# EAGLE design honda-z50a-regulator (EAGLE 9.5.1)
CNAME: None; CREVISION: 1.0; DESIGNER: Joao Silva
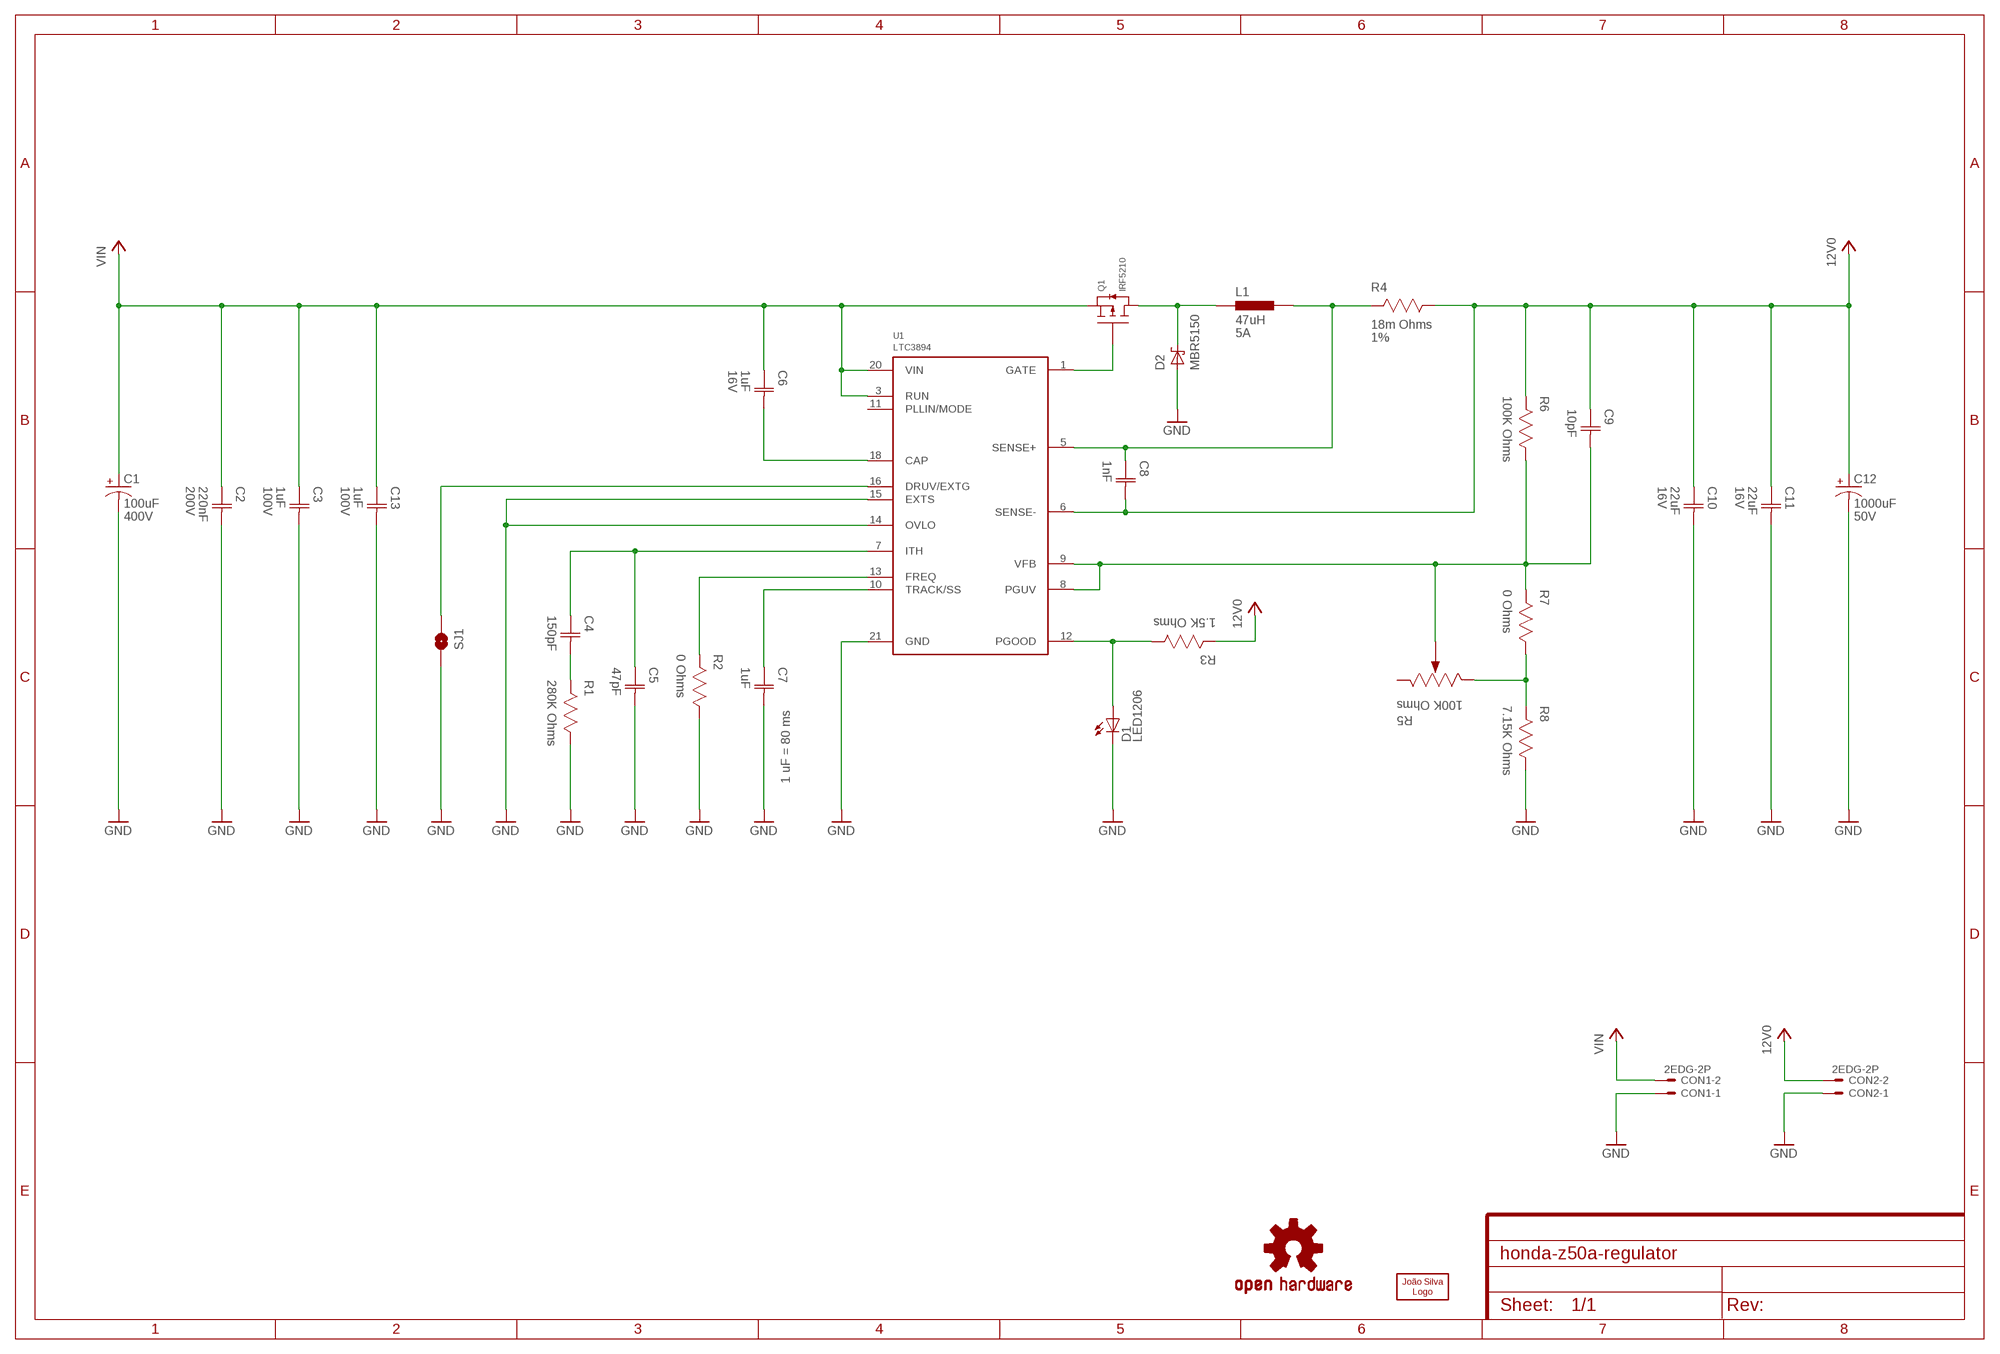
[diagram p0: schematic, sheet 1]

## Parts
C1  100uF  ELETROLITIC-CAPACITOR-18MM  [EL-CAP-18MM]
C2  220nF  CAPACITOR-1206  [CAP1206]
C3  1uF  CAPACITOR-1206  [CAP1206]
C4  150pF  CAPACITOR-0603  [CAP0603]
C5  47pF  CAPACITOR-0603  [CAP0603]
C6  1uF  CAPACITOR-0603  [CAP0603]
C7  1uF  CAPACITOR-0603  [CAP0603]
C8  1nF  CAPACITOR-0603  [CAP0603]
C9  10pF  CAPACITOR-0603  [CAP0603]
C10  22uF  CAPACITOR-1206  [CAP1206]
C11  22uF  CAPACITOR-1206  [CAP1206]
C12  1000uF  ELETROLITIC-CAPACITOR-13MM  [EL-CAP-13MM]
C13  1uF  CAPACITOR-1206  [CAP1206]
CON1  2EDG-2P  [2EDG-2P]
CON2  2EDG-2P  [2EDG-2P]
D1  LED1206  [1206]
D2  MBR5150  [DO201AD]
L1  47uH  INDUCTOR-13X13X6.5MM  [IND1365]
LOGO1  OSHW-LOGOS  [OSHW-LOGO-S]
LOGO2  JS-5MM  [JS_5MM]
Q1  IRF5210  [TO262-HS]
R1  280K Ohms  RESISTOR-0603  [RES0603]
R2  0 Ohms  RESISTOR-0603  [RES0603]
R3  1.5K Ohms  RESISTOR-0603  [RES0603]
R4  18m Ohms  RESISTOR-2512  [RES2512]
R5  100K Ohms  POTENTIOMETER-TH  [TRIMMER]
R6  100K Ohms  RESISTOR-0603  [RES0603]
R7  0 Ohms  RESISTOR-0603  [RES0603]
R8  7.15K Ohms  RESISTOR-0603  [RES0603]
SJ1  SJS  [SJ_S]
U1  LTC3894  [MSOP20_HV_EP]

## Nets
12V0: C8.2(C2) C9.1(C1) C10.1(C1) C11.1(C1) C12.+ CON2.P$2 R3.2 R4.1 R6.2 U1.6(SENSE-)
CAP: C6.2(C2) U1.18(CAP)
DRUV: SJ1.1 U1.16(DRUV/EXTG)
FREQ: R2.2 U1.13(FREQ)
GATE: Q1.G U1.1(GATE)
GND: C1.- C2.2(C2) C3.2(C2) C5.2(C2) C7.2(C2) C10.2(C2) C11.2(C2) C12.- C13.2(C2) CON1.P$1 CON2.P$1 D1.C D2.A R1.1 R2.1 R8.1 SJ1.2 U1.14(OVLO) U1.15(EXTS) U1.21(GND)
ISENSE: C8.1(C1) L1.2 R4.2 U1.5(SENSE+)
ITH: C4.1(C1) C5.1(C1) U1.7(ITH)
N$1: R5.E(CW) R7.1 R8.2
N$9: C4.2(C2) R1.2
PGOOD: D1.A R3.1 U1.12(PGOOD)
SS: C7.1(C1) U1.10(TRACK/SS)
SW [HV]: D2.C L1.1 Q1.D
VFB: C9.2(C2) R5.S(WIPER) R6.1 R7.2 U1.8(PGUV) U1.9(VFB)
VIN [HV]: C1.+ C2.1(C1) C3.1(C1) C6.1(C1) C13.1(C1) CON1.P$2 Q1.S U1.3(RUN) U1.20(VIN)
Unconnected: R5.A(CCW) U1.11(PLLIN/MODE)

## Notes on the sheet
- 1 uF = 80 ms

## Library data of the parts
C1 = Capacitor:ELETROLITIC-CAPACITOR; VOLTAGE: 400V
C2 = Capacitor:CAPACITOR; VOLTAGE: 200V
C3 C13 = Capacitor:CAPACITOR; VOLTAGE: 100V
C4 C5 C7-C9 = Capacitor:CAPACITOR
C6 C10 C11 = Capacitor:CAPACITOR; VOLTAGE: 16V
C12 = Capacitor:ELETROLITIC-CAPACITOR; VOLTAGE: 50V
CON1 CON2 = Generic Connector:2EDG-2P
D1 = LED:LED
D2 = Generic Diode:MBR5150
L1 = Inductor:INDUCTOR; CURRENT: 5A; OCLCSC: C429835
LOGO1 = Silkscreen:OSHW-LOGO: Open-Source Hardware (OSHW) Logo This logo indicates the piece of hardware it is found on incorporates a OSHW license and/or adheres to the definition of open source hardware found here: http://freedomdefined.org/OSHW
LOGO2 = Silkscreen:JS
Q1 = Generic MOSFET:IRF5210
R1-R3 R6-R8 = Resistor:RESISTOR
R4 = Resistor:RESISTOR; OCLCSC: C270951; TOLERANCE: 1%
R5 = Potentiometer:POTENTIOMETER
SJ1 = Solder Jumper:SJ
U1 = Analog Devices:LTC3894

## Net classes
1 HV: clearance 0.8 mm

## Board
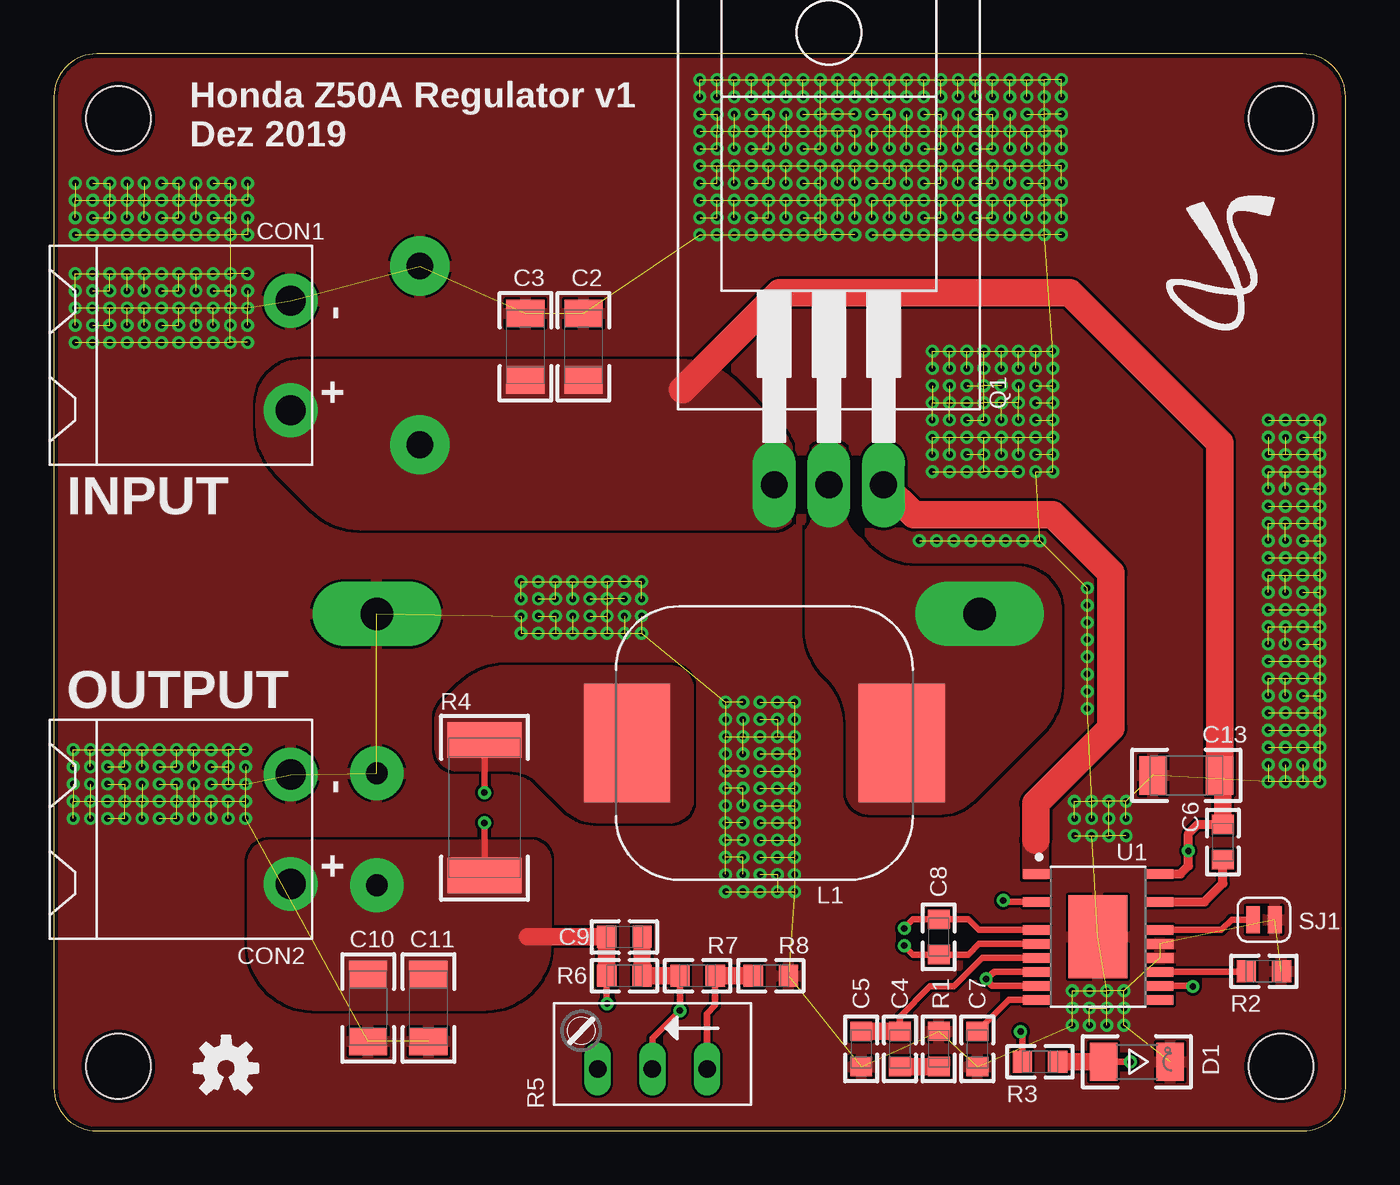
[diagram p1: board, top side]
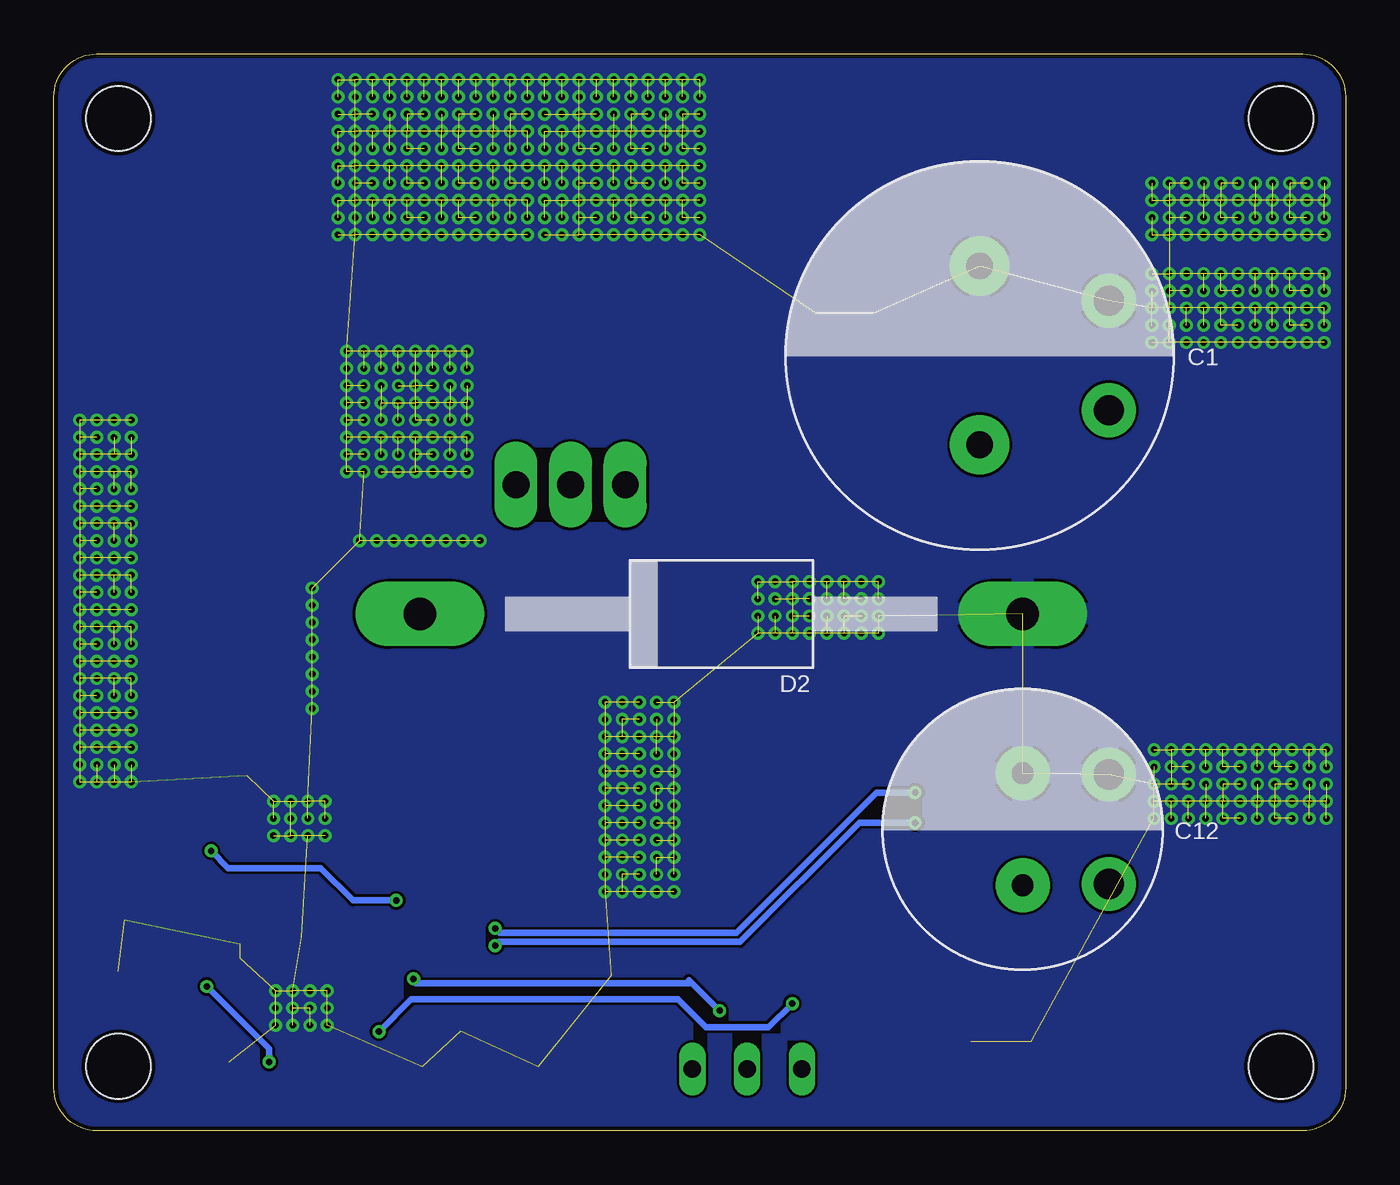
[diagram p2: board, bottom side, seen from below]

Size 60 x 50 mm. Coordinates in mm from the lower left corner, seen from the top.
Outline: 0,48 0,2 arc90 2,0 58,0 arc90 60,2 60,48 arc90 58,50 2,50 arc90 0,48
Copper layers (1*16): Top 0.035mm / dielectric 1.6mm / Bottom 0.035mm
Design rules "jlcpcb_2layer": minimum track width 5mil, minimum drill 0.3mm, track to track 5mil, track to pad 5mil, pad to pad 5mil, via to via 5mil, smd to smd 5mil, copper to edge 0.2mm, drill to drill 5mil, minimum pad ring 3mil, minimum via ring 3mil, stop-mask expansion 0.075mm, vias tented up to drill 10mm, thermal gap 5mil
Holes 3 mm at 57,3 3,47 57,47 3,3

### Footprints (pad centres in the part's own frame; a part is rotated, then mirrored left to right if it is on the bottom)
EL-CAP-18MM = drill 1.25 pad 2.75: + -4.15,0; - 4.15,0
CAP1206 = smd 1.27 x 1.778: 1 -1.549,0; 2 1.549,0
CAP0603 = smd 0.889 x 1.016: 1 -0.819,0; 2 0.819,0
EL-CAP-13MM = drill 1 pad 2.5: + -2.6,0; - 2.6,0
2EDG-2P = drill 1.4 pad 2.5: P$1 -2.54,0; P$2 2.54,0
1206 = smd 1.27 x 1.778: A 1.549,0; C -1.549,0
DO201AD = drill 1.5 pad 3 long: A -14,0; C 14,0
IND1365 = smd 4 x 5.5: 1 -6.375,0; 2 6.375,0
TO262-HS = drill 1.25 pad 2 long: D 0,-9; G 2.54,-9; S -2.54,-9
RES0603 = smd 0.889 x 1.016: 1 -0.819,0; 2 0.819,0
RES2512 = smd 1.651 x 3.429: 1 -3.15,0; 2 3.15,0
TRIMMER = drill 0.813 long: A 2.54,0.635; E -2.54,0.635; S 0,0.635
SJ_S = smd 0.635 x 1.27: 1 -0.508,0; 2 0.508,0
MSOP20_HV_EP = smd 1.25 x 0.45: 1 -2.875,2.925; 3 -2.875,1.625; 5 -2.875,0.325; 6 -2.875,-0.325; 7 -2.875,-0.975; 8 -2.875,-1.625; 9 -2.875,-2.275; 10 -2.875,-2.925; 11 2.875,-2.925; 12 2.875,-2.275; 13 2.875,-1.625; 14 2.875,-0.975; 15 2.875,-0.325; 16 2.875,0.325; 18 2.875,1.625; 20 2.875,2.925 | smd 2.74 x 3.86: 21 0,0

### Placement (x,y rotation side)
C1  17,36 90 bottom
C2  24.6,36.4 90 top
C3  21.9,36.4 90 top
C4  39.3,3.8 270 top
C5  37.5,3.8 270 top
C6  54.3,13.4 270 top
C7  42.9,3.8 270 top
C8  41.1,9 270 top
C9  26.5,9 0 top
C10  14.6,5.7 270 top
C11  17.4,5.7 270 top
C12  15,14 90 bottom
C13  52.6,16.5 180 top
CON1  11,36 270 top
CON2  11,14 270 top
D1  50.3,3.2 180 top
D2  29,24 180 bottom
L1  33,18 180 top
LOGO1  8,2.9 0 top
LOGO2  56.9,43.6 0 top
Q1  36,39 0 top
R1  41.1,3.8 270 top
R2  56.2,7.4 180 top
R3  45.8,3.2 180 top
R4  20,15 90 top
R5  27.8,3.5 180 top
R6  26.5,7.2 180 top
R7  29.9,7.2 180 top
R8  33.3,7.2 180 top
SJ1  56.2,9.8 0 top
U1  48.5,9 0 top

### Tracks (layer width: path | path; a pad name or v marks a point on that pad's centre or on a via)
12V0  (via drill 0.3)
  Top 0.305: R4.1 v20,14.3 | v39.5,8.6 39.5,8.58 39.9,8.18 C8.2 42.48,8.18 42.98,8.68 U1.6 | R6.2 25.68,5.92 v25.7,5.9 | v44.9,4.6 44.98,4.52 R3.2
  Top 0.813: 22,9 C9.1 R6.2
  Bottom 0.305: v20,14.3 22.59,14.3 28.12,8.77 39.33,8.77 v39.5,8.6 | v25.7,5.9 26.8,4.8 29.7,4.8 31,6.1 43.4,6.1 v44.9,4.6
  pour Top (no thermals): 23,12.5 23,8.7 arc-90 20,5.7 12.1,5.7 arc-90 9.1,8.7 9.1,12.4 arc-90 10.1,13.4 22.1,13.4 arc-90
CAP
  Top 0.406: U1.18 53.44,10.62 54.3,11.48 C6.2
DRUV
  Top 0.305: U1.16 54.23,9.32 54.7,9.8 SJ1.1
FREQ
  Top 0.305: U1.13 55.36,7.38 R2.2
GATE
  Top 1.27: Q1.G 39.94,28.6 46.4,28.6 49.1,25.9 49.1,18.7 45.6,15.2 45.6,13.5
  pour Top (no thermals): 46.1,11.8 45.1,11.8 45.1,13.7 46.1,13.7
GND  (via drill 0.3)  (677 unrouted)
  other vias: 1,41.6 1.8,41.6 2.6,41.6 3.4,41.6 4.2,41.6 5,41.6 5.8,41.6 6.6,41.6 7.4,41.6 1,42.4 1.8,42.4 2.6,42.4 3.4,42.4 4.2,42.4 5,42.4 5.8,42.4 6.6,42.4 7.4,42.4 1,43.2 1.8,43.2 2.6,43.2 3.4,43.2 4.2,43.2 5,43.2 5.8,43.2 6.6,43.2 7.4,43.2 1,44 1.8,44 2.6,44 3.4,44 4.2,44 5,44 5.8,44 6.6,44 7.4,44 8.2,41.6 9,41.6 8.2,42.4 9,42.4 8.2,43.2 9,43.2 8.2,44 9,44 1,39.8 1.8,39.8 2.6,39.8 3.4,39.8 4.2,39.8 5,39.8 5.8,39.8 6.6,39.8 7.4,39.8 1,36.6 1.8,36.6 2.6,36.6 3.4,36.6 4.2,36.6 5,36.6 5.8,36.6 6.6,36.6 7.4,36.6 1,37.4 1.8,37.4 2.6,37.4 3.4,37.4 4.2,37.4 5,37.4 5.8,37.4 6.6,37.4 7.4,37.4 1,38.2 1.8,38.2 2.6,38.2 3.4,38.2 4.2,38.2 5,38.2 5.8,38.2 6.6,38.2 7.4,38.2 1,39 1.8,39 2.6,39 3.4,39 4.2,39 5,39 5.8,39 6.6,39 7.4,39 8.2,39.8 9,39.8 8.2,36.6 9,36.6 8.2,37.4 9,37.4 8.2,38.2 9,38.2 8.2,39 9,39 30,44.8 30.8,44.8 31.6,44.8 32.4,44.8 33.2,44.8 34,44.8 34.8,44.8 35.6,44.8 36.4,44.8 30,41.6 30.8,41.6 31.6,41.6 32.4,41.6 33.2,41.6 34,41.6 34.8,41.6 35.6,41.6 36.4,41.6 30,42.4 30.8,42.4 31.6,42.4 32.4,42.4 33.2,42.4 34,42.4 34.8,42.4 35.6,42.4 36.4,42.4 30,43.2 30.8,43.2 31.6,43.2 32.4,43.2 33.2,43.2 34,43.2 34.8,43.2 35.6,43.2 36.4,43.2 30,44 30.8,44 31.6,44 32.4,44 33.2,44 34,44 34.8,44 35.6,44 36.4,44 37.2,44.8 38,44.8 37.2,41.6 38,41.6 37.2,42.4 38,42.4 37.2,43.2 38,43.2 37.2,44 38,44 30,48.8 30.8,48.8 31.6,48.8 32.4,48.8 33.2,48.8 34,48.8 34.8,48.8 35.6,48.8 36.4,48.8 30,45.6 30.8,45.6 31.6,45.6 32.4,45.6 33.2,45.6 34,45.6 34.8,45.6 35.6,45.6 36.4,45.6 30,46.4 30.8,46.4 31.6,46.4 32.4,46.4 33.2,46.4 34,46.4 34.8,46.4 35.6,46.4 36.4,46.4 30,47.2 30.8,47.2 31.6,47.2 32.4,47.2 33.2,47.2 34,47.2 34.8,47.2 35.6,47.2 36.4,47.2 30,48 30.8,48 31.6,48 32.4,48 33.2,48 34,48 34.8,48 35.6,48 36.4,48 37.2,48.8 38,48.8 37.2,45.6 38,45.6 37.2,46.4 38,46.4 37.2,47.2 38,47.2 37.2,48 38,48 38.8,44.8 39.6,44.8 40.4,44.8 41.2,44.8 42,44.8 42.8,44.8 43.6,44.8 44.4,44.8 45.2,44.8 38.8,41.6 39.6,41.6 40.4,41.6 41.2,41.6 42,41.6 42.8,41.6 43.6,41.6 44.4,41.6 45.2,41.6 38.8,42.4 39.6,42.4 40.4,42.4 41.2,42.4 42,42.4 42.8,42.4 43.6,42.4 44.4,42.4 45.2,42.4 38.8,43.2 39.6,43.2 40.4,43.2 41.2,43.2 42,43.2 42.8,43.2 43.6,43.2 44.4,43.2 45.2,43.2 38.8,44 39.6,44 40.4,44 41.2,44 42,44 42.8,44 43.6,44 44.4,44 45.2,44 46,44.8 46.8,44.8 46,41.6 46.8,41.6 46,42.4 46.8,42.4 46,43.2 46.8,43.2 46,44 46.8,44 38.8,48.8 39.6,48.8 40.4,48.8 41.2,48.8 42,48.8 42.8,48.8 43.6,48.8 44.4,48.8 45.2,48.8 38.8,45.6 39.6,45.6 40.4,45.6 41.2,45.6 42,45.6 42.8,45.6 43.6,45.6 44.4,45.6 45.2,45.6 38.8,46.4 39.6,46.4 40.4,46.4 41.2,46.4 42,46.4 42.8,46.4 43.6,46.4 44.4,46.4 45.2,46.4 38.8,47.2 39.6,47.2 40.4,47.2 41.2,47.2 42,47.2 42.8,47.2 43.6,47.2 44.4,47.2 45.2,47.2 38.8,48 39.6,48 40.4,48 41.2,48 42,48 42.8,48 43.6,48 44.4,48 45.2,48 46,48.8 46.8,48.8 46,45.6 46.8,45.6 46,46.4 46.8,46.4 46,47.2 46.8,47.2 46,48 46.8,48 40.8,32.2 41.6,32.2 42.4,32.2 43.2,32.2 44,32.2 44.8,32.2 40.8,30.6 41.6,30.6 42.4,30.6 43.2,30.6 44,30.6 44.8,30.6 40.8,31.4 41.6,31.4 42.4,31.4 43.2,31.4 44,31.4 44.8,31.4 45.6,32.2 46.4,32.2 45.6,30.6 46.4,30.6 45.6,31.4 46.4,31.4 40.8,36.2 41.6,36.2 42.4,36.2 43.2,36.2 44,36.2 44.8,36.2 40.8,33 41.6,33 42.4,33 43.2,33 44,33 44.8,33 40.8,33.8 41.6,33.8 42.4,33.8 43.2,33.8 44,33.8 44.8,33.8 40.8,34.6 41.6,34.6 42.4,34.6 43.2,34.6 44,34.6 44.8,34.6 40.8,35.4 41.6,35.4 42.4,35.4 43.2,35.4 44,35.4 44.8,35.4 45.6,36.2 46.4,36.2 45.6,33 46.4,33 45.6,33.8 46.4,33.8 45.6,34.6 46.4,34.6 45.6,35.4 46.4,35.4 40.2,27.4 41,27.4 41.8,27.4 42.6,27.4 43.4,27.4 44.2,27.4 45,27.4 45.8,27.4 48,19.6 48,20.4 48,21.2 48,22 48,22.8 48,23.6 48,24.4 48,25.2 47.4,15.3 48.2,15.3 47.4,13.7 48.2,13.7 47.4,14.5 48.2,14.5 49,15.3 49.8,15.3 49,13.7 49.8,13.7 49,14.5 49.8,14.5 47.3,6.5 48.1,6.5 47.3,4.9 48.1,4.9 47.3,5.7 48.1,5.7 48.9,6.5 49.7,6.5 48.9,4.9 49.7,4.9 48.9,5.7 49.7,5.7 58.8,16.2 58.8,17 58.8,17.8 58.8,18.6 58.8,19.4 58.8,20.2 58.8,21 58.8,21.8 58.8,22.6 58,16.2 58,17 58,17.8 58,18.6 58,19.4 58,20.2 58,21 58,21.8 58,22.6 57.2,16.2 57.2,17 57.2,17.8 57.2,18.6 57.2,19.4 57.2,20.2 57.2,21 57.2,21.8 57.2,22.6 56.4,16.2 56.4,17 56.4,17.8 56.4,18.6 56.4,19.4 56.4,20.2 56.4,21 56.4,21.8 56.4,22.6 58.8,23.4 58.8,24.2 58,23.4 58,24.2 57.2,23.4 57.2,24.2 56.4,23.4 56.4,24.2 58.8,25 58.8,25.8 58.8,26.6 58.8,27.4 58.8,28.2 58.8,29 58.8,29.8 58.8,30.6 58.8,31.4 58,25 58,25.8 58,26.6 58,27.4 58,28.2 58,29 58,29.8 58,30.6 58,31.4 57.2,25 57.2,25.8 57.2,26.6 57.2,27.4 57.2,28.2 57.2,29 57.2,29.8 57.2,30.6 57.2,31.4 56.4,25 56.4,25.8 56.4,26.6 56.4,27.4 56.4,28.2 56.4,29 56.4,29.8 56.4,30.6 56.4,31.4 58.8,32.2 58.8,33 58,32.2 58,33 57.2,32.2 57.2,33 56.4,32.2 56.4,33 31.2,11.1 34.4,11.1 33.6,11.1 32.8,11.1 32,11.1 31.2,11.9 31.2,12.7 31.2,13.5 31.2,14.3 31.2,15.1 31.2,15.9 31.2,16.7 31.2,17.5 31.2,18.3 34.4,11.9 34.4,12.7 34.4,13.5 34.4,14.3 34.4,15.1 34.4,15.9 34.4,16.7 34.4,17.5 34.4,18.3 33.6,11.9 33.6,12.7 33.6,13.5 33.6,14.3 33.6,15.1 33.6,15.9 33.6,16.7 33.6,17.5 33.6,18.3 32.8,11.9 32.8,12.7 32.8,13.5 32.8,14.3 32.8,15.1 32.8,15.9 32.8,16.7 32.8,17.5 32.8,18.3 32,11.9 32,12.7 32,13.5 32,14.3 32,15.1 32,15.9 32,16.7 32,17.5 32,18.3 31.2,19.1 31.2,19.9 34.4,19.1 34.4,19.9 33.6,19.1 33.6,19.9 32.8,19.1 32.8,19.9 32,19.1 32,19.9 0.9,17.7 1.7,17.7 2.5,17.7 3.3,17.7 4.1,17.7 4.9,17.7 5.7,17.7 6.5,17.7 7.3,17.7 0.9,14.5 1.7,14.5 2.5,14.5 3.3,14.5 4.1,14.5 4.9,14.5 5.7,14.5 6.5,14.5 7.3,14.5 0.9,15.3 1.7,15.3 2.5,15.3 3.3,15.3 4.1,15.3 4.9,15.3 5.7,15.3 6.5,15.3 7.3,15.3 0.9,16.1 1.7,16.1 2.5,16.1 3.3,16.1 4.1,16.1 4.9,16.1 5.7,16.1 6.5,16.1 7.3,16.1 0.9,16.9 1.7,16.9 2.5,16.9 3.3,16.9 4.1,16.9 4.9,16.9 5.7,16.9 6.5,16.9 7.3,16.9 8.1,17.7 8.9,17.7 8.1,14.5 8.9,14.5 8.1,15.3 8.9,15.3 8.1,16.1 8.9,16.1 8.1,16.9 8.9,16.9 21.7,23.1 22.5,23.1 23.3,23.1 24.1,23.1 24.9,23.1 25.7,23.1 21.7,23.9 22.5,23.9 23.3,23.9 24.1,23.9 24.9,23.9 25.7,23.9 21.7,24.7 22.5,24.7 23.3,24.7 24.1,24.7 24.9,24.7 25.7,24.7 21.7,25.5 22.5,25.5 23.3,25.5 24.1,25.5 24.9,25.5 25.7,25.5 26.5,23.1 27.3,23.1 26.5,23.9 27.3,23.9 26.5,24.7 27.3,24.7 26.5,25.5 27.3,25.5
  pour Top (rank 6): -1,51 61,51 61,-1 -1,-1
  pour Bottom (rank 6): -2.5,52.5 62.5,52.5 62.5,-2.5 -2.5,-2.5
ISENSE  (via drill 0.3)
  Top 0.305: R4.2 v20,15.7 | v39.5,9.4 39.5,9.42 39.9,9.82 C8.1 42.48,9.82 42.98,9.32 U1.5
  Bottom 0.305: v20,15.7 21.8,15.7 28.3,9.2 39.3,9.2 v39.5,9.4
  pour Top (no thermals): 18.92,20.62 18.09,19.79 arc45 17.8,19.09 17.8,17.8 arc90 18.8,16.8 21.17,16.8 arc-45 22.59,16.21 23.81,14.99 arc45 25.23,14.4 28.6,14.4 arc90 29.6,15.4 29.6,20.5 arc90 28.6,21.5 21.04,21.5 arc45
ITH
  Top 0.305: U1.7 43.12,8.03 41.8,6.7 40.7,6.7 39.3,5.3 C4.1
  Top 0.813: C4.1 C5.1
N$1
  Top 0.305: R5.E 30.34,5.44 30.72,5.82 R7.1
  Top 0.813: R7.1 R8.2
N$9
  Top 0.813: C4.2 R1.2
PGOOD  (via drill 0.3)
  Top 0.305: U1.12 52.88,6.72 v52.9,6.7 | v50,3.2 D1.A
  Top 0.813: R3.1 D1.A
  Bottom 0.305: v52.9,6.7 50,3.8 v50,3.2
SS
  Top 0.305: U1.10 44.36,6.08 C7.1
SW
  pour Top (no thermals): 41.17,14.8 37.9,14.8 arc-90 36.9,15.8 36.9,18.96 arc45 36.02,21.08 35.88,21.22 arc-45 35,23.34 35,30.9 arc-90 36,31.9 arc-90 37,30.9 37,28.96 arc45 37.82,26.98 arc45 39.94,26.1 44.7,26.1 arc-90 46.7,24.1 46.7,20.74 arc-45 45.82,18.62 42.59,15.39 arc-45
VFB  (via drill 0.3)
  Top 0.305: R5.S 27.8,4.3 v29.08,5.58 R7.2 | U1.8 43.67,7.38 v43.3,7.05 43.58,6.72 U1.9
  Top 0.813: C9.2 R6.1 R7.2
  Bottom 0.305: 30.5,7 v29.08,5.58 30.35,6.85 43.2,6.85 43.3,6.95 v43.3,7.05
VIN  (via drill 0.3)
  Top 0.305: U1.3 44.17,10.62 v44.1,10.7 | v52.69,13 v52.7,13
  Top 0.406: U1.20 52.33,11.93 52.7,12.3 v52.7,13 52.7,13.8 53.12,14.22 C6.1
  Top 0.813: C6.1 54.3,16.35 C13.1
  Top 1.27: C13.1 54.15,31.95 47.2,38.9 33.7,38.9 29.2,34.4
  Bottom 0.305: v44.1,10.7 46.1,10.7 47.6,12.2 51.89,12.2 v52.69,13
  pour Top (no thermals): 11.5,35.7 29.34,35.7 arc-45 31.46,34.82 33.52,32.76 arc-45 34.4,30.64 34.4,29 arc-90 33.4,28 14.24,28 arc-45 12.12,28.88 10.38,30.62 arc-45 9.5,32.74 9.5,33.7 arc-90

### Text on the board
tPlace: Honda Z50A Regulator v1 / Dez 2019 | + - | INPUT | OUTPUT | + -